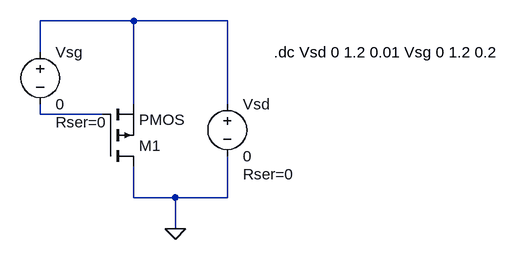
[diagram p0: schematic PmosSweep.asc]
PmosSweep.asc, the LTspice schematic file:
Version 4
SHEET 1 880 680
WIRE 128 -32 -16 -32
WIRE 272 -32 128 -32
WIRE -16 16 -16 -32
WIRE 128 96 128 -32
WIRE 272 96 272 -32
WIRE -16 112 -16 96
WIRE 80 112 -16 112
WIRE 128 240 128 192
WIRE 192 240 128 240
WIRE 272 240 272 176
WIRE 272 240 192 240
WIRE 192 288 192 240
FLAG 192 288 0
SYMBOL pmos 80 192 M180
SYMATTR InstName M1
SYMBOL voltage 272 80 R0
WINDOW 123 0 0 Left 2
WINDOW 39 24 124 Left 2
SYMATTR InstName Vsd
SYMATTR Value 0
SYMATTR SpiceLine Rser=0
SYMBOL voltage -16 0 R0
WINDOW 123 0 0 Left 2
WINDOW 39 24 124 Left 2
SYMATTR InstName Vsg
SYMATTR Value 0
SYMATTR SpiceLine Rser=0
TEXT 344 16 Left 2 !.dc Vsd 0 1.2 0.01 Vsg 0 1.2 0.2

The netlist it stands for:
* PmosSweep.asc
M1 0 N002 N001 N001 PMOS
Vsd N001 0 0 Rser=0
Vsg N001 N002 0 Rser=0
.model NMOS NMOS
.model PMOS PMOS
.lib standard.mos
.dc Vsd 0 1.2 0.01 Vsg 0 1.2 0.2
.backanno
.end